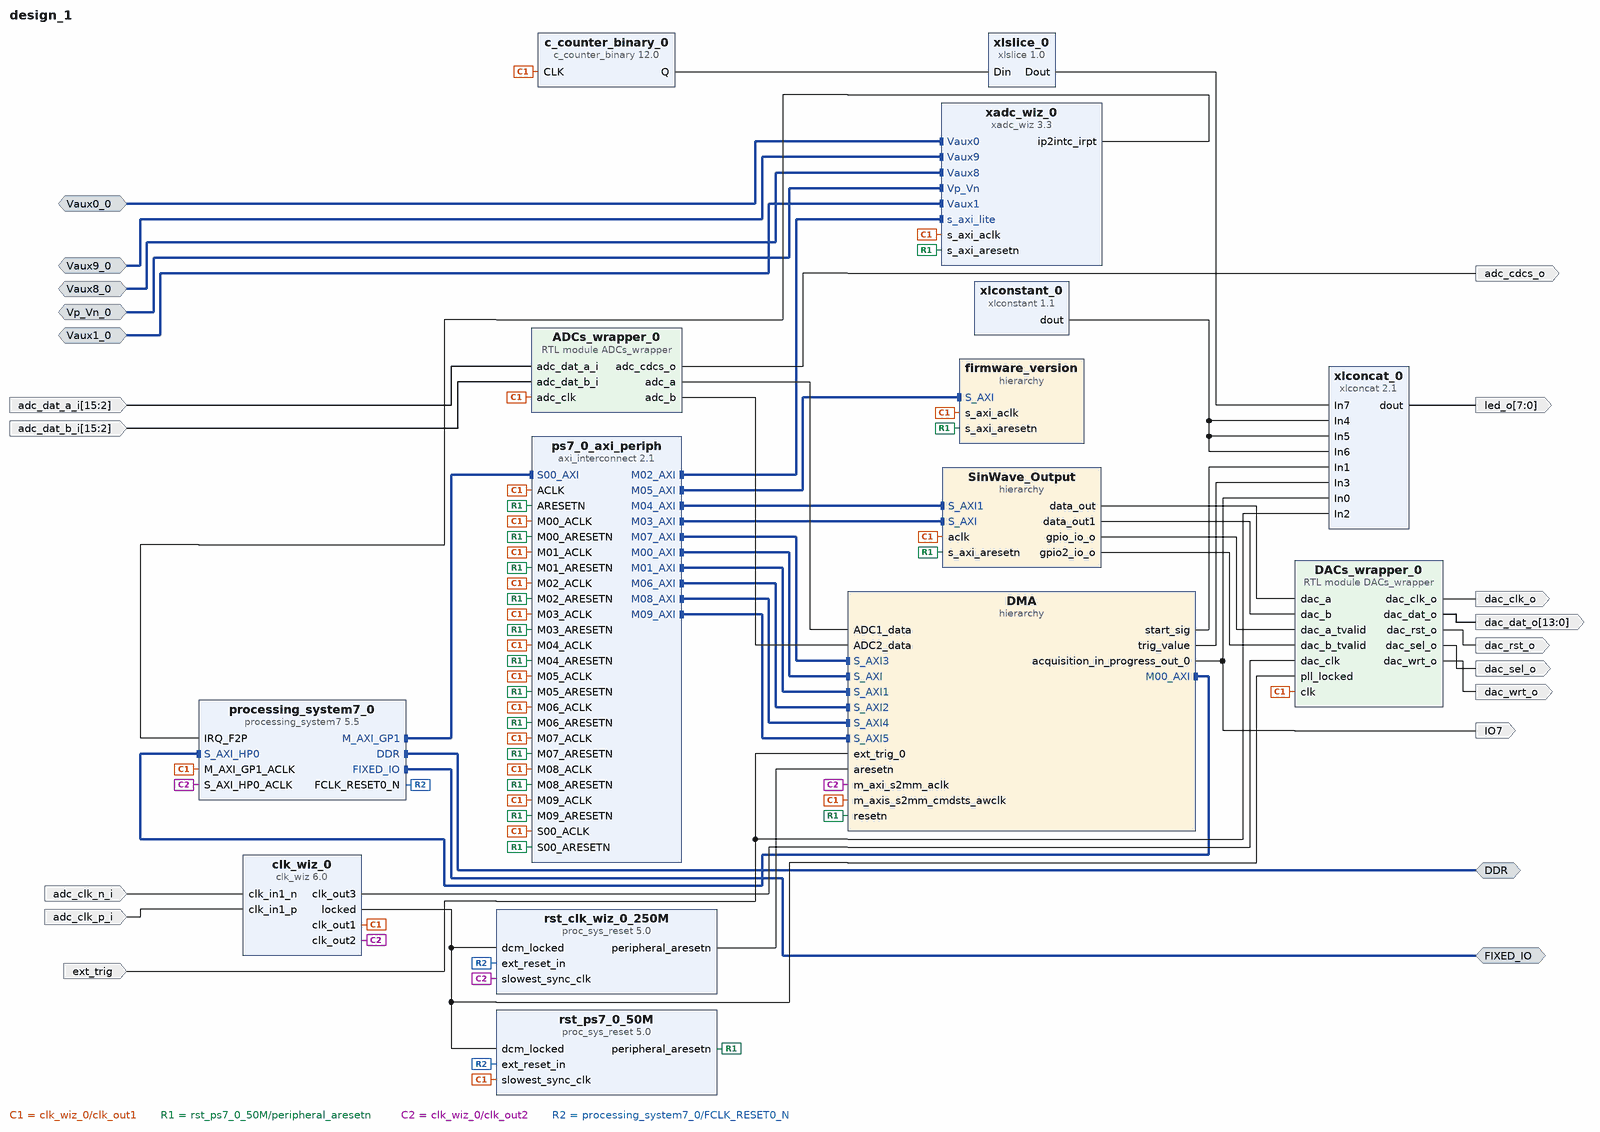
[diagram p0: block diagram of the top level]
# Vivado block design design_1, xc7z010clg400-1, Vivado 2019.1
create_bd_design design_1

create_bd_intf_port -mode Master -vlnv xilinx.com:interface:ddrx_rtl:1.0 DDR
create_bd_intf_port -mode Master -vlnv xilinx.com:display_processing_system7:fixedio_rtl:1.0 FIXED_IO
create_bd_intf_port -mode Slave -vlnv xilinx.com:interface:diff_analog_io_rtl:1.0 Vp_Vn_0
create_bd_intf_port -mode Slave -vlnv xilinx.com:interface:diff_analog_io_rtl:1.0 Vaux8_0
create_bd_intf_port -mode Slave -vlnv xilinx.com:interface:diff_analog_io_rtl:1.0 Vaux0_0
create_bd_intf_port -mode Slave -vlnv xilinx.com:interface:diff_analog_io_rtl:1.0 Vaux1_0
create_bd_intf_port -mode Slave -vlnv xilinx.com:interface:diff_analog_io_rtl:1.0 Vaux9_0
create_bd_port -dir I -type clk adc_clk_p_i
set_property -dict {CONFIG.FREQ_HZ 125000000} [get_bd_ports adc_clk_p_i]
create_bd_port -dir I -type clk adc_clk_n_i
set_property -dict {CONFIG.FREQ_HZ 125000000} [get_bd_ports adc_clk_n_i]
create_bd_port -dir I -from 15 -to 2 adc_dat_a_i
create_bd_port -dir I -from 15 -to 2 adc_dat_b_i
create_bd_port -dir O adc_cdcs_o
create_bd_port -dir O -from 13 -to 0 dac_dat_o
create_bd_port -dir O dac_wrt_o
create_bd_port -dir O dac_sel_o
create_bd_port -dir O dac_clk_o
create_bd_port -dir O dac_rst_o
create_bd_port -dir O IO7
create_bd_port -dir I ext_trig
create_bd_port -dir O -from 7 -to 0 led_o

create_bd_cell -type ip -vlnv xilinx.com:ip:processing_system7:5.5 processing_system7_0
set_property -dict [list \
  CONFIG.PCW_APU_PERIPHERAL_FREQMHZ 666.666666 \
  CONFIG.PCW_ENET0_ENET0_IO {MIO 16 .. 27} \
  CONFIG.PCW_ENET0_GRP_MDIO_ENABLE 1 \
  CONFIG.PCW_ENET0_GRP_MDIO_IO {MIO 52 .. 53} \
  CONFIG.PCW_ENET0_PERIPHERAL_ENABLE 1 \
  CONFIG.PCW_ENET0_RESET_ENABLE 0 \
  CONFIG.PCW_ENET_RESET_ENABLE 1 \
  CONFIG.PCW_ENET_RESET_SELECT {Share reset pin} \
  CONFIG.PCW_EN_CLK0_PORT 0 \
  CONFIG.PCW_FPGA0_PERIPHERAL_FREQMHZ 125 \
  CONFIG.PCW_FPGA1_PERIPHERAL_FREQMHZ 50 \
  CONFIG.PCW_GPIO_EMIO_GPIO_ENABLE 1 \
  CONFIG.PCW_GPIO_EMIO_GPIO_IO 64 \
  CONFIG.PCW_GPIO_MIO_GPIO_ENABLE 1 \
  CONFIG.PCW_GPIO_MIO_GPIO_IO MIO \
  CONFIG.PCW_GPIO_PERIPHERAL_ENABLE 1 \
  CONFIG.PCW_I2C0_GRP_INT_ENABLE 0 \
  CONFIG.PCW_I2C0_I2C0_IO {MIO 50 .. 51} \
  CONFIG.PCW_I2C0_PERIPHERAL_ENABLE 1 \
  CONFIG.PCW_I2C_PERIPHERAL_FREQMHZ 111.111115 \
  CONFIG.PCW_I2C_RESET_ENABLE 1 \
  CONFIG.PCW_I2C_RESET_SELECT {Share reset pin} \
  CONFIG.PCW_IMPORT_BOARD_PRESET {D:/Alex/Red Pitaya/red_pitaya.xml} \
  CONFIG.PCW_IRQ_F2P_INTR 1 \
  CONFIG.PCW_PRESET_BANK1_VOLTAGE {LVCMOS 2.5V} \
  CONFIG.PCW_QSPI_PERIPHERAL_ENABLE 0 \
  CONFIG.PCW_SD0_GRP_CD_ENABLE 1 \
  CONFIG.PCW_SD0_GRP_CD_IO {MIO 46} \
  CONFIG.PCW_SD0_GRP_WP_ENABLE 1 \
  CONFIG.PCW_SD0_GRP_WP_IO {MIO 47} \
  CONFIG.PCW_SD0_PERIPHERAL_ENABLE 1 \
  CONFIG.PCW_SD0_SD0_IO {MIO 40 .. 45} \
  CONFIG.PCW_SDIO_PERIPHERAL_FREQMHZ 100 \
  CONFIG.PCW_SPI0_PERIPHERAL_ENABLE 1 \
  CONFIG.PCW_SPI0_SPI0_IO EMIO \
  CONFIG.PCW_SPI1_PERIPHERAL_ENABLE 1 \
  CONFIG.PCW_SPI1_SPI1_IO {MIO 10 .. 15} \
  CONFIG.PCW_UART0_PERIPHERAL_ENABLE 1 \
  CONFIG.PCW_UART0_UART0_IO {MIO 14 .. 15} \
  CONFIG.PCW_UART1_PERIPHERAL_ENABLE 1 \
  CONFIG.PCW_UART1_UART1_IO {MIO 8 .. 9} \
  CONFIG.PCW_UART_PERIPHERAL_FREQMHZ 100 \
  CONFIG.PCW_UIPARAM_DDR_BUS_WIDTH {16 Bit} \
  CONFIG.PCW_UIPARAM_DDR_FREQ_MHZ 533.333333 \
  CONFIG.PCW_UIPARAM_DDR_PARTNO {MT41J256M16 RE-125} \
  CONFIG.PCW_USB0_PERIPHERAL_ENABLE 1 \
  CONFIG.PCW_USB0_RESET_ENABLE 1 \
  CONFIG.PCW_USB0_RESET_IO {MIO 48} \
  CONFIG.PCW_USB0_USB0_IO {MIO 28 .. 39} \
  CONFIG.PCW_USB_RESET_ENABLE 1 \
  CONFIG.PCW_USB_RESET_SELECT {Share reset pin} \
  CONFIG.PCW_USE_FABRIC_INTERRUPT 1 \
  CONFIG.PCW_USE_M_AXI_GP0 0 \
  CONFIG.PCW_USE_M_AXI_GP1 1 \
  CONFIG.PCW_USE_S_AXI_HP0 1 \
] [get_bd_cells processing_system7_0]
# 429 more settings of processing_system7_0 are not shown: defaults, MIO pin electricals, DDR timing, and values the tool derives
create_bd_cell -type ip -vlnv xilinx.com:ip:proc_sys_reset:5.0 rst_ps7_0_50M
create_bd_cell -type ip -vlnv xilinx.com:ip:clk_wiz:6.0 clk_wiz_0
set_property -dict [list \
  CONFIG.CLKIN1_JITTER_PS 80.0 \
  CONFIG.CLKOUT1_JITTER 119.348 \
  CONFIG.CLKOUT1_PHASE_ERROR 96.948 \
  CONFIG.CLKOUT1_REQUESTED_OUT_FREQ 125.000 \
  CONFIG.CLKOUT2_JITTER 109.241 \
  CONFIG.CLKOUT2_PHASE_ERROR 96.948 \
  CONFIG.CLKOUT2_REQUESTED_OUT_FREQ 200 \
  CONFIG.CLKOUT2_USED true \
  CONFIG.CLKOUT3_JITTER 104.759 \
  CONFIG.CLKOUT3_PHASE_ERROR 96.948 \
  CONFIG.CLKOUT3_REQUESTED_OUT_FREQ 250 \
  CONFIG.CLKOUT3_REQUESTED_PHASE 90 \
  CONFIG.CLKOUT3_USED true \
  CONFIG.MMCM_CLKFBOUT_MULT_F 8.000 \
  CONFIG.MMCM_CLKIN1_PERIOD 8.000 \
  CONFIG.MMCM_CLKOUT0_DIVIDE_F 8.000 \
  CONFIG.MMCM_CLKOUT1_DIVIDE 5 \
  CONFIG.MMCM_CLKOUT2_DIVIDE 4 \
  CONFIG.MMCM_CLKOUT2_PHASE 90.000 \
  CONFIG.NUM_OUT_CLKS 3 \
  CONFIG.PRIM_IN_FREQ 125.000 \
  CONFIG.PRIM_SOURCE Differential_clock_capable_pin \
  CONFIG.USE_RESET false \
] [get_bd_cells clk_wiz_0]
create_bd_cell -type ip -vlnv xilinx.com:ip:proc_sys_reset:5.0 rst_clk_wiz_0_250M
create_bd_cell -type ip -vlnv xilinx.com:ip:axi_interconnect:2.1 ps7_0_axi_periph
set_property -dict {CONFIG.NUM_MI 10} [get_bd_cells ps7_0_axi_periph]
create_bd_cell -type ip -vlnv xilinx.com:ip:xadc_wiz:3.3 xadc_wiz_0
set_property -dict [list \
  CONFIG.ADC_OFFSET_AND_GAIN_CALIBRATION false \
  CONFIG.CHANNEL_ENABLE_VAUXP0_VAUXN0 true \
  CONFIG.CHANNEL_ENABLE_VAUXP1_VAUXN1 true \
  CONFIG.CHANNEL_ENABLE_VAUXP8_VAUXN8 true \
  CONFIG.CHANNEL_ENABLE_VAUXP9_VAUXN9 true \
  CONFIG.CHANNEL_ENABLE_VP_VN true \
  CONFIG.EXTERNAL_MUX_CHANNEL VP_VN \
  CONFIG.SEQUENCER_MODE Off \
  CONFIG.SINGLE_CHANNEL_ENABLE_CALIBRATION true \
  CONFIG.SINGLE_CHANNEL_SELECTION TEMPERATURE \
  CONFIG.XADC_STARUP_SELECTION independent_adc \
] [get_bd_cells xadc_wiz_0]
create_bd_cell -type module -reference ADCs_wrapper ADCs_wrapper_0
create_bd_cell -type module -reference DACs_wrapper DACs_wrapper_0
create_bd_cell -type hier firmware_version
create_bd_cell -type hier SinWave_Output
create_bd_cell -type hier DMA
create_bd_cell -type ip -vlnv xilinx.com:ip:xlconcat:2.1 xlconcat_0
set_property -dict {CONFIG.NUM_PORTS 8} [get_bd_cells xlconcat_0]
create_bd_cell -type ip -vlnv xilinx.com:ip:c_counter_binary:12.0 c_counter_binary_0
set_property -dict {CONFIG.Output_Width 27} [get_bd_cells c_counter_binary_0]
create_bd_cell -type ip -vlnv xilinx.com:ip:xlslice:1.0 xlslice_0
set_property -dict {CONFIG.DIN_FROM 26 CONFIG.DIN_TO 26 CONFIG.DIN_WIDTH 27 CONFIG.DOUT_WIDTH 1} [get_bd_cells xlslice_0]
create_bd_cell -type ip -vlnv xilinx.com:ip:xlconstant:1.1 xlconstant_0
set_property -dict {CONFIG.CONST_VAL 0} [get_bd_cells xlconstant_0]

# ---- hierarchy /firmware_version ----
current_bd_instance /firmware_version
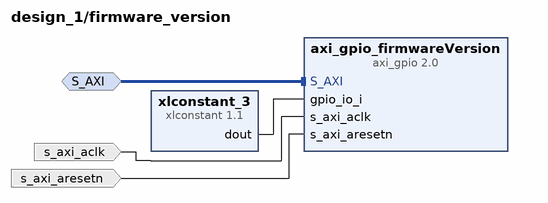
[diagram p1: block diagram inside /firmware_version]
create_bd_intf_pin -mode Slave -vlnv xilinx.com:interface:aximm_rtl:1.0 S_AXI
create_bd_pin -dir I -type clk s_axi_aclk
create_bd_pin -dir I -type rst s_axi_aresetn

create_bd_cell -type ip -vlnv xilinx.com:ip:xlconstant:1.1 xlconstant_3
set_property -dict {CONFIG.CONST_VAL 0xADC00003 CONFIG.CONST_WIDTH 32} [get_bd_cells xlconstant_3]
create_bd_cell -type ip -vlnv xilinx.com:ip:axi_gpio:2.0 axi_gpio_firmwareVersion
set_property -dict {CONFIG.C_ALL_INPUTS 1} [get_bd_cells axi_gpio_firmwareVersion]

# ---- hierarchy /SinWave_Output ----
current_bd_instance /SinWave_Output
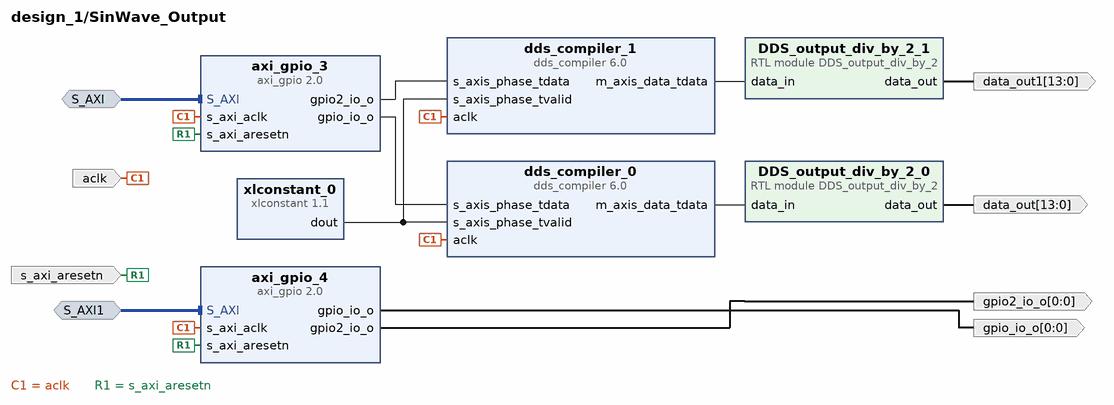
[diagram p2: block diagram inside /SinWave_Output]
create_bd_intf_pin -mode Slave -vlnv xilinx.com:interface:aximm_rtl:1.0 S_AXI
create_bd_intf_pin -mode Slave -vlnv xilinx.com:interface:aximm_rtl:1.0 S_AXI1
create_bd_pin -dir O -from 13 -to 0 data_out
create_bd_pin -dir O -from 13 -to 0 data_out1
create_bd_pin -dir I -type clk aclk
create_bd_pin -dir I -type rst s_axi_aresetn
create_bd_pin -dir O -from 0 -to 0 gpio_io_o
create_bd_pin -dir O -from 0 -to 0 gpio2_io_o

create_bd_cell -type module -reference DDS_output_div_by_2 DDS_output_div_by_2_0
create_bd_cell -type module -reference DDS_output_div_by_2 DDS_output_div_by_2_1
create_bd_cell -type ip -vlnv xilinx.com:ip:dds_compiler:6.0 dds_compiler_0
set_property -dict [list \
  CONFIG.DATA_Has_TLAST Not_Required \
  CONFIG.DDS_Clock_Rate 125 \
  CONFIG.DSP48_Use Maximal \
  CONFIG.Frequency_Resolution 0.4 \
  CONFIG.Has_Phase_Out false \
  CONFIG.Latency 8 \
  CONFIG.M_DATA_Has_TUSER Not_Required \
  CONFIG.Noise_Shaping None \
  CONFIG.Output_Frequency1 0 \
  CONFIG.Output_Selection Sine \
  CONFIG.Output_Width 14 \
  CONFIG.PINC1 0 \
  CONFIG.Parameter_Entry Hardware_Parameters \
  CONFIG.PartsPresent Phase_Generator_and_SIN_COS_LUT \
  CONFIG.Phase_Increment Streaming \
  CONFIG.Phase_Width 32 \
  CONFIG.Phase_offset None \
  CONFIG.S_PHASE_Has_TUSER Not_Required \
] [get_bd_cells dds_compiler_0]
create_bd_cell -type ip -vlnv xilinx.com:ip:dds_compiler:6.0 dds_compiler_1
set_property -dict [list \
  CONFIG.DATA_Has_TLAST Not_Required \
  CONFIG.DDS_Clock_Rate 125 \
  CONFIG.DSP48_Use Maximal \
  CONFIG.Frequency_Resolution 0.4 \
  CONFIG.Has_Phase_Out false \
  CONFIG.Latency 8 \
  CONFIG.M_DATA_Has_TUSER Not_Required \
  CONFIG.Noise_Shaping None \
  CONFIG.Output_Frequency1 0 \
  CONFIG.Output_Selection Sine \
  CONFIG.Output_Width 14 \
  CONFIG.PINC1 0 \
  CONFIG.Parameter_Entry Hardware_Parameters \
  CONFIG.PartsPresent Phase_Generator_and_SIN_COS_LUT \
  CONFIG.Phase_Increment Streaming \
  CONFIG.Phase_Width 32 \
  CONFIG.Phase_offset None \
  CONFIG.S_PHASE_Has_TUSER Not_Required \
] [get_bd_cells dds_compiler_1]
create_bd_cell -type ip -vlnv xilinx.com:ip:axi_gpio:2.0 axi_gpio_3
set_property -dict {CONFIG.C_ALL_OUTPUTS 1 CONFIG.C_ALL_OUTPUTS_2 1 CONFIG.C_IS_DUAL 1} [get_bd_cells axi_gpio_3]
create_bd_cell -type ip -vlnv xilinx.com:ip:axi_gpio:2.0 axi_gpio_4
set_property -dict [list \
  CONFIG.C_ALL_OUTPUTS 1 \
  CONFIG.C_ALL_OUTPUTS_2 1 \
  CONFIG.C_GPIO2_WIDTH 1 \
  CONFIG.C_GPIO_WIDTH 1 \
  CONFIG.C_IS_DUAL 1 \
] [get_bd_cells axi_gpio_4]
create_bd_cell -type ip -vlnv xilinx.com:ip:xlconstant:1.1 xlconstant_0

# ---- hierarchy /DMA ----
current_bd_instance /DMA
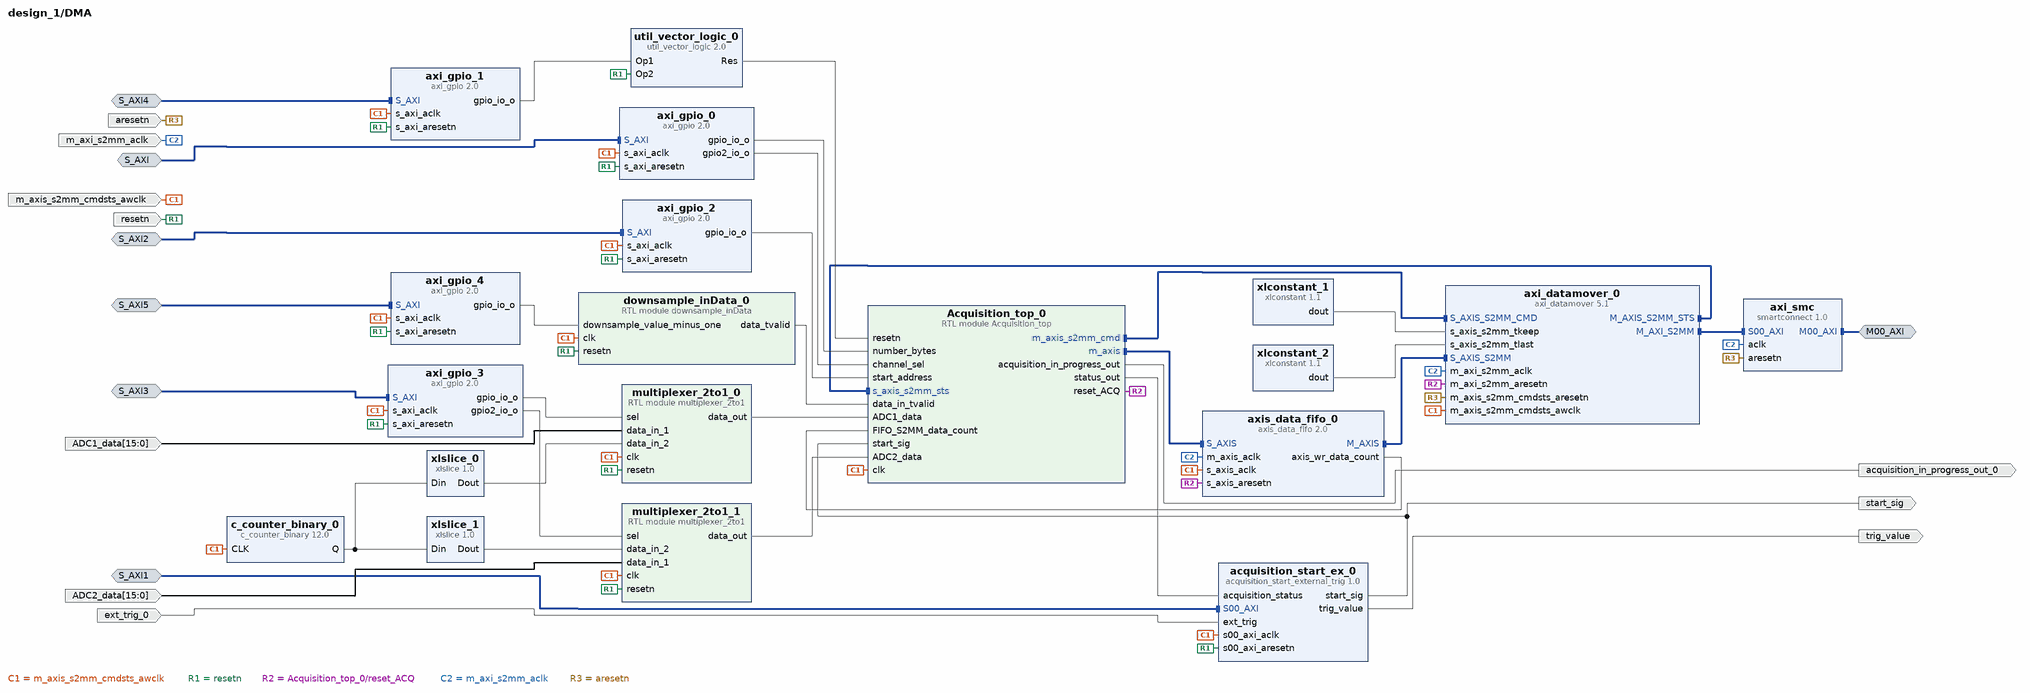
[diagram p3: block diagram inside /DMA]
create_bd_intf_pin -mode Slave -vlnv xilinx.com:interface:aximm_rtl:1.0 S_AXI
create_bd_intf_pin -mode Master -vlnv xilinx.com:interface:aximm_rtl:1.0 M00_AXI
create_bd_intf_pin -mode Slave -vlnv xilinx.com:interface:aximm_rtl:1.0 S_AXI1
create_bd_intf_pin -mode Slave -vlnv xilinx.com:interface:aximm_rtl:1.0 S_AXI2
create_bd_intf_pin -mode Slave -vlnv xilinx.com:interface:aximm_rtl:1.0 S_AXI3
create_bd_intf_pin -mode Slave -vlnv xilinx.com:interface:aximm_rtl:1.0 S_AXI4
create_bd_intf_pin -mode Slave -vlnv xilinx.com:interface:aximm_rtl:1.0 S_AXI5
create_bd_pin -dir I -type clk m_axis_s2mm_cmdsts_awclk
create_bd_pin -dir I -type rst resetn
create_bd_pin -dir I -type clk m_axi_s2mm_aclk
create_bd_pin -dir I -type rst aresetn
create_bd_pin -dir I -from 15 -to 0 ADC1_data
create_bd_pin -dir I -from 15 -to 0 ADC2_data
create_bd_pin -dir O acquisition_in_progress_out_0
create_bd_pin -dir I ext_trig_0
create_bd_pin -dir O start_sig
create_bd_pin -dir O trig_value

create_bd_cell -type ip -vlnv xilinx.com:ip:xlconstant:1.1 xlconstant_1
set_property -dict {CONFIG.CONST_VAL 255 CONFIG.CONST_WIDTH 8} [get_bd_cells xlconstant_1]
create_bd_cell -type ip -vlnv xilinx.com:ip:axi_gpio:2.0 axi_gpio_0
set_property -dict [list \
  CONFIG.C_ALL_OUTPUTS 1 \
  CONFIG.C_ALL_OUTPUTS_2 1 \
  CONFIG.C_GPIO2_WIDTH 2 \
  CONFIG.C_IS_DUAL 1 \
] [get_bd_cells axi_gpio_0]
create_bd_cell -type ip -vlnv xilinx.com:ip:smartconnect:1.0 axi_smc
set_property -dict {CONFIG.NUM_SI 1} [get_bd_cells axi_smc]
create_bd_cell -type ip -vlnv xilinx.com:ip:axis_data_fifo:2.0 axis_data_fifo_0
set_property -dict [list \
  CONFIG.FIFO_DEPTH 128 \
  CONFIG.HAS_AFULL 1 \
  CONFIG.HAS_RD_DATA_COUNT 1 \
  CONFIG.HAS_TKEEP 0 \
  CONFIG.HAS_TLAST 0 \
  CONFIG.HAS_WR_DATA_COUNT 1 \
  CONFIG.IS_ACLK_ASYNC 1 \
  CONFIG.TDATA_NUM_BYTES 8 \
] [get_bd_cells axis_data_fifo_0]
create_bd_cell -type ip -vlnv xilinx.com:ip:xlconstant:1.1 xlconstant_2
set_property -dict {CONFIG.CONST_VAL 0} [get_bd_cells xlconstant_2]
create_bd_cell -type ip -vlnv xilinx.com:ip:axi_gpio:2.0 axi_gpio_2
set_property -dict {CONFIG.C_ALL_OUTPUTS 1 CONFIG.C_DOUT_DEFAULT 0x1e000000} [get_bd_cells axi_gpio_2]
create_bd_cell -type ip -vlnv xilinx.com:ip:axi_datamover:5.1 axi_datamover_0
set_property -dict [list \
  CONFIG.c_dummy 0 \
  CONFIG.c_enable_mm2s 0 \
  CONFIG.c_m_axi_s2mm_data_width 64 \
  CONFIG.c_m_axi_s2mm_id_width 0 \
  CONFIG.c_s2mm_btt_used 23 \
  CONFIG.c_s2mm_burst_size 256 \
  CONFIG.c_s_axis_s2mm_tdata_width 64 \
] [get_bd_cells axi_datamover_0]
create_bd_cell -type ip -vlnv xilinx.com:ip:xlslice:1.0 xlslice_1
set_property -dict {CONFIG.DIN_FROM 15 CONFIG.DOUT_WIDTH 16} [get_bd_cells xlslice_1]
create_bd_cell -type ip -vlnv xilinx.com:ip:c_counter_binary:12.0 c_counter_binary_0
set_property -dict {CONFIG.Output_Width 32} [get_bd_cells c_counter_binary_0]
create_bd_cell -type ip -vlnv xilinx.com:ip:xlslice:1.0 xlslice_0
set_property -dict {CONFIG.DIN_FROM 31 CONFIG.DIN_TO 16 CONFIG.DOUT_WIDTH 16} [get_bd_cells xlslice_0]
create_bd_cell -type ip -vlnv xilinx.com:ip:axi_gpio:2.0 axi_gpio_3
set_property -dict [list \
  CONFIG.C_ALL_OUTPUTS 1 \
  CONFIG.C_ALL_OUTPUTS_2 1 \
  CONFIG.C_GPIO2_WIDTH 1 \
  CONFIG.C_GPIO_WIDTH 1 \
  CONFIG.C_IS_DUAL 1 \
] [get_bd_cells axi_gpio_3]
create_bd_cell -type module -reference multiplexer_2to1 multiplexer_2to1_0
create_bd_cell -type module -reference multiplexer_2to1 multiplexer_2to1_1
create_bd_cell -type ip -vlnv xilinx.com:ip:util_vector_logic:2.0 util_vector_logic_0
set_property -dict {CONFIG.C_SIZE 1} [get_bd_cells util_vector_logic_0]
create_bd_cell -type ip -vlnv xilinx.com:ip:axi_gpio:2.0 axi_gpio_1
set_property -dict {CONFIG.C_ALL_OUTPUTS 1 CONFIG.C_DOUT_DEFAULT 0x00000001 CONFIG.C_GPIO_WIDTH 1} [get_bd_cells axi_gpio_1]
create_bd_cell -type ip -vlnv xilinx.com:user:acquisition_start_external_trig:1.0 acquisition_start_ex_0
create_bd_cell -type module -reference Acquisition_top Acquisition_top_0
create_bd_cell -type ip -vlnv xilinx.com:ip:axi_gpio:2.0 axi_gpio_4
set_property -dict {CONFIG.C_ALL_OUTPUTS 1 CONFIG.C_DOUT_DEFAULT 0x00000000} [get_bd_cells axi_gpio_4]
create_bd_cell -type module -reference downsample_inData downsample_inData_0

# ---- connections ----

current_bd_instance /firmware_version
connect_bd_intf_net [get_bd_intf_pins S_AXI] [get_bd_intf_pins axi_gpio_firmwareVersion/S_AXI]
connect_bd_net [get_bd_pins xlconstant_3/dout] [get_bd_pins axi_gpio_firmwareVersion/gpio_io_i]
connect_bd_net -net processing_system7_0_FCLK_CLK0 [get_bd_pins s_axi_aclk] [get_bd_pins axi_gpio_firmwareVersion/s_axi_aclk]
connect_bd_net -net rst_ps7_0_50M_peripheral_aresetn [get_bd_pins s_axi_aresetn] [get_bd_pins axi_gpio_firmwareVersion/s_axi_aresetn]

current_bd_instance /SinWave_Output
connect_bd_intf_net [get_bd_intf_pins S_AXI] [get_bd_intf_pins axi_gpio_3/S_AXI]
connect_bd_intf_net [get_bd_intf_pins S_AXI1] [get_bd_intf_pins axi_gpio_4/S_AXI]
connect_bd_net [get_bd_pins dds_compiler_0/m_axis_data_tdata] [get_bd_pins DDS_output_div_by_2_0/data_in]
connect_bd_net [get_bd_pins dds_compiler_1/m_axis_data_tdata] [get_bd_pins DDS_output_div_by_2_1/data_in]
connect_bd_net -net axi_gpio_2_gpio_io_o [get_bd_pins axi_gpio_3/gpio_io_o] [get_bd_pins dds_compiler_0/s_axis_phase_tdata]
connect_bd_net -net axi_gpio_2_gpio2_io_o [get_bd_pins axi_gpio_3/gpio2_io_o] [get_bd_pins dds_compiler_1/s_axis_phase_tdata]
connect_bd_net -net dds_compiler_0_m_axis_data_tdata [get_bd_pins DDS_output_div_by_2_0/data_out] [get_bd_pins data_out]
connect_bd_net [get_bd_pins DDS_output_div_by_2_1/data_out] [get_bd_pins data_out1]
connect_bd_net -net processing_system7_0_FCLK_CLK0 [get_bd_pins aclk] \
  [get_bd_pins dds_compiler_1/aclk] [get_bd_pins axi_gpio_3/s_axi_aclk] [get_bd_pins dds_compiler_0/aclk] \
  [get_bd_pins axi_gpio_4/s_axi_aclk]
connect_bd_net [get_bd_pins xlconstant_0/dout] [get_bd_pins dds_compiler_1/s_axis_phase_tvalid] [get_bd_pins dds_compiler_0/s_axis_phase_tvalid]
connect_bd_net -net rst_ps7_0_50M_peripheral_aresetn [get_bd_pins s_axi_aresetn] \
  [get_bd_pins axi_gpio_3/s_axi_aresetn] [get_bd_pins axi_gpio_4/s_axi_aresetn]
connect_bd_net -net axi_gpio_3_gpio_io_o [get_bd_pins axi_gpio_4/gpio_io_o] [get_bd_pins gpio_io_o]
connect_bd_net -net axi_gpio_3_gpio2_io_o [get_bd_pins axi_gpio_4/gpio2_io_o] [get_bd_pins gpio2_io_o]

current_bd_instance /DMA
connect_bd_intf_net [get_bd_intf_pins Acquisition_top_0/m_axis] [get_bd_intf_pins axis_data_fifo_0/S_AXIS]
connect_bd_intf_net [get_bd_intf_pins S_AXI3] [get_bd_intf_pins axi_gpio_3/S_AXI]
connect_bd_intf_net [get_bd_intf_pins S_AXI5] [get_bd_intf_pins axi_gpio_4/S_AXI]
connect_bd_intf_net [get_bd_intf_pins S_AXI4] [get_bd_intf_pins axi_gpio_1/S_AXI]
connect_bd_intf_net [get_bd_intf_pins axi_datamover_0/M_AXIS_S2MM_STS] [get_bd_intf_pins Acquisition_top_0/s_axis_s2mm_sts]
connect_bd_intf_net [get_bd_intf_pins axis_data_fifo_0/M_AXIS] [get_bd_intf_pins axi_datamover_0/S_AXIS_S2MM]
connect_bd_intf_net [get_bd_intf_pins S_AXI2] [get_bd_intf_pins axi_gpio_2/S_AXI]
connect_bd_intf_net [get_bd_intf_pins M00_AXI] [get_bd_intf_pins axi_smc/M00_AXI]
connect_bd_intf_net [get_bd_intf_pins Acquisition_top_0/m_axis_s2mm_cmd] [get_bd_intf_pins axi_datamover_0/S_AXIS_S2MM_CMD]
connect_bd_intf_net -intf_net S_AXI1_1 [get_bd_intf_pins S_AXI1] [get_bd_intf_pins acquisition_start_ex_0/S00_AXI]
connect_bd_intf_net [get_bd_intf_pins axi_datamover_0/M_AXI_S2MM] [get_bd_intf_pins axi_smc/S00_AXI]
connect_bd_intf_net [get_bd_intf_pins S_AXI] [get_bd_intf_pins axi_gpio_0/S_AXI]
connect_bd_net -net processing_system7_0_FCLK_CLK0 [get_bd_pins m_axis_s2mm_cmdsts_awclk] \
  [get_bd_pins axi_gpio_0/s_axi_aclk] [get_bd_pins axis_data_fifo_0/s_axis_aclk] [get_bd_pins axi_gpio_2/s_axi_aclk] \
  [get_bd_pins axi_datamover_0/m_axis_s2mm_cmdsts_awclk] [get_bd_pins c_counter_binary_0/CLK] \
  [get_bd_pins axi_gpio_3/s_axi_aclk] [get_bd_pins multiplexer_2to1_0/clk] [get_bd_pins multiplexer_2to1_1/clk] \
  [get_bd_pins axi_gpio_1/s_axi_aclk] [get_bd_pins acquisition_start_ex_0/s00_axi_aclk] [get_bd_pins Acquisition_top_0/clk] \
  [get_bd_pins axi_gpio_4/s_axi_aclk] [get_bd_pins downsample_inData_0/clk]
connect_bd_net -net rst_ps7_0_50M_peripheral_aresetn [get_bd_pins resetn] \
  [get_bd_pins axi_gpio_0/s_axi_aresetn] [get_bd_pins axi_gpio_2/s_axi_aresetn] [get_bd_pins axi_gpio_3/s_axi_aresetn] \
  [get_bd_pins multiplexer_2to1_0/resetn] [get_bd_pins multiplexer_2to1_1/resetn] [get_bd_pins util_vector_logic_0/Op2] \
  [get_bd_pins axi_gpio_1/s_axi_aresetn] [get_bd_pins acquisition_start_ex_0/s00_axi_aresetn] \
  [get_bd_pins axi_gpio_4/s_axi_aresetn] [get_bd_pins downsample_inData_0/resetn]
connect_bd_net [get_bd_pins Acquisition_top_0/reset_ACQ] \
  [get_bd_pins axis_data_fifo_0/s_axis_aresetn] [get_bd_pins axi_datamover_0/m_axi_s2mm_aresetn]
connect_bd_net -net clk_wiz_0_clk_out2 [get_bd_pins m_axi_s2mm_aclk] \
  [get_bd_pins axi_smc/aclk] [get_bd_pins axis_data_fifo_0/m_axis_aclk] [get_bd_pins axi_datamover_0/m_axi_s2mm_aclk]
connect_bd_net [get_bd_pins axi_gpio_0/gpio_io_o] [get_bd_pins Acquisition_top_0/number_bytes]
connect_bd_net [get_bd_pins axi_gpio_0/gpio2_io_o] [get_bd_pins Acquisition_top_0/channel_sel]
connect_bd_net [get_bd_pins aresetn] [get_bd_pins axi_smc/aresetn] [get_bd_pins axi_datamover_0/m_axis_s2mm_cmdsts_aresetn]
connect_bd_net [get_bd_pins axis_data_fifo_0/axis_wr_data_count] [get_bd_pins Acquisition_top_0/FIFO_S2MM_data_count]
connect_bd_net [get_bd_pins axi_gpio_2/gpio_io_o] [get_bd_pins Acquisition_top_0/start_address]
connect_bd_net [get_bd_pins xlconstant_1/dout] [get_bd_pins axi_datamover_0/s_axis_s2mm_tkeep]
connect_bd_net [get_bd_pins xlconstant_2/dout] [get_bd_pins axi_datamover_0/s_axis_s2mm_tlast]
connect_bd_net [get_bd_pins c_counter_binary_0/Q] [get_bd_pins xlslice_1/Din] [get_bd_pins xlslice_0/Din]
connect_bd_net -net data_in_1_0_1 [get_bd_pins ADC1_data] [get_bd_pins multiplexer_2to1_0/data_in_1]
connect_bd_net -net data_in_1_1_1 [get_bd_pins ADC2_data] [get_bd_pins multiplexer_2to1_1/data_in_1]
connect_bd_net [get_bd_pins xlslice_0/Dout] [get_bd_pins multiplexer_2to1_0/data_in_2]
connect_bd_net [get_bd_pins xlslice_1/Dout] [get_bd_pins multiplexer_2to1_1/data_in_2]
connect_bd_net [get_bd_pins multiplexer_2to1_1/data_out] [get_bd_pins Acquisition_top_0/ADC2_data]
connect_bd_net [get_bd_pins multiplexer_2to1_0/data_out] [get_bd_pins Acquisition_top_0/ADC1_data]
connect_bd_net [get_bd_pins axi_gpio_3/gpio_io_o] [get_bd_pins multiplexer_2to1_0/sel]
connect_bd_net [get_bd_pins axi_gpio_3/gpio2_io_o] [get_bd_pins multiplexer_2to1_1/sel]
connect_bd_net [get_bd_pins Acquisition_top_0/acquisition_in_progress_out] [get_bd_pins acquisition_in_progress_out_0]
connect_bd_net [get_bd_pins acquisition_start_ex_0/start_sig] [get_bd_pins start_sig] [get_bd_pins Acquisition_top_0/start_sig]
connect_bd_net [get_bd_pins Acquisition_top_0/status_out] [get_bd_pins acquisition_start_ex_0/acquisition_status]
connect_bd_net -net ext_trig_0_1 [get_bd_pins ext_trig_0] [get_bd_pins acquisition_start_ex_0/ext_trig]
connect_bd_net [get_bd_pins acquisition_start_ex_0/trig_value] [get_bd_pins trig_value]
connect_bd_net [get_bd_pins util_vector_logic_0/Res] [get_bd_pins Acquisition_top_0/resetn]
connect_bd_net [get_bd_pins axi_gpio_1/gpio_io_o] [get_bd_pins util_vector_logic_0/Op1]
connect_bd_net [get_bd_pins axi_gpio_4/gpio_io_o] [get_bd_pins downsample_inData_0/downsample_value_minus_one]
connect_bd_net [get_bd_pins downsample_inData_0/data_tvalid] [get_bd_pins Acquisition_top_0/data_in_tvalid]

current_bd_instance /
connect_bd_intf_net [get_bd_intf_ports DDR] [get_bd_intf_pins processing_system7_0/DDR]
connect_bd_intf_net [get_bd_intf_ports FIXED_IO] [get_bd_intf_pins processing_system7_0/FIXED_IO]
connect_bd_intf_net [get_bd_intf_pins ps7_0_axi_periph/M04_AXI] [get_bd_intf_pins SinWave_Output/S_AXI1]
connect_bd_intf_net -intf_net Vaux0_0_1 [get_bd_intf_ports Vaux0_0] [get_bd_intf_pins xadc_wiz_0/Vaux0]
connect_bd_intf_net [get_bd_intf_pins ps7_0_axi_periph/M07_AXI] [get_bd_intf_pins DMA/S_AXI3]
connect_bd_intf_net [get_bd_intf_pins ps7_0_axi_periph/M05_AXI] [get_bd_intf_pins firmware_version/S_AXI]
connect_bd_intf_net [get_bd_intf_pins ps7_0_axi_periph/M03_AXI] [get_bd_intf_pins SinWave_Output/S_AXI]
connect_bd_intf_net -intf_net Vaux9_0_1 [get_bd_intf_ports Vaux9_0] [get_bd_intf_pins xadc_wiz_0/Vaux9]
connect_bd_intf_net -intf_net Vaux8_0_1 [get_bd_intf_ports Vaux8_0] [get_bd_intf_pins xadc_wiz_0/Vaux8]
connect_bd_intf_net -intf_net Vp_Vn_0_1 [get_bd_intf_ports Vp_Vn_0] [get_bd_intf_pins xadc_wiz_0/Vp_Vn]
connect_bd_intf_net -intf_net Vaux1_0_1 [get_bd_intf_ports Vaux1_0] [get_bd_intf_pins xadc_wiz_0/Vaux1]
connect_bd_intf_net [get_bd_intf_pins ps7_0_axi_periph/M00_AXI] [get_bd_intf_pins DMA/S_AXI]
connect_bd_intf_net [get_bd_intf_pins ps7_0_axi_periph/M01_AXI] [get_bd_intf_pins DMA/S_AXI1]
connect_bd_intf_net [get_bd_intf_pins ps7_0_axi_periph/M06_AXI] [get_bd_intf_pins DMA/S_AXI2]
connect_bd_intf_net [get_bd_intf_pins ps7_0_axi_periph/M08_AXI] [get_bd_intf_pins DMA/S_AXI4]
connect_bd_intf_net [get_bd_intf_pins processing_system7_0/S_AXI_HP0] [get_bd_intf_pins DMA/M00_AXI]
connect_bd_intf_net [get_bd_intf_pins processing_system7_0/M_AXI_GP1] [get_bd_intf_pins ps7_0_axi_periph/S00_AXI]
connect_bd_intf_net [get_bd_intf_pins ps7_0_axi_periph/M02_AXI] [get_bd_intf_pins xadc_wiz_0/s_axi_lite]
connect_bd_intf_net [get_bd_intf_pins ps7_0_axi_periph/M09_AXI] [get_bd_intf_pins DMA/S_AXI5]
connect_bd_net -net processing_system7_0_FCLK_CLK0 [get_bd_pins clk_wiz_0/clk_out1] \
  [get_bd_pins rst_ps7_0_50M/slowest_sync_clk] [get_bd_pins ps7_0_axi_periph/M00_ACLK] \
  [get_bd_pins ps7_0_axi_periph/S00_ACLK] [get_bd_pins ps7_0_axi_periph/ACLK] [get_bd_pins ps7_0_axi_periph/M01_ACLK] \
  [get_bd_pins processing_system7_0/M_AXI_GP1_ACLK] [get_bd_pins xadc_wiz_0/s_axi_aclk] \
  [get_bd_pins ps7_0_axi_periph/M02_ACLK] [get_bd_pins ps7_0_axi_periph/M03_ACLK] [get_bd_pins ADCs_wrapper_0/adc_clk] \
  [get_bd_pins ps7_0_axi_periph/M04_ACLK] [get_bd_pins DACs_wrapper_0/clk] [get_bd_pins ps7_0_axi_periph/M05_ACLK] \
  [get_bd_pins firmware_version/s_axi_aclk] [get_bd_pins SinWave_Output/aclk] [get_bd_pins DMA/m_axis_s2mm_cmdsts_awclk] \
  [get_bd_pins ps7_0_axi_periph/M06_ACLK] [get_bd_pins ps7_0_axi_periph/M07_ACLK] [get_bd_pins c_counter_binary_0/CLK] \
  [get_bd_pins ps7_0_axi_periph/M08_ACLK] [get_bd_pins ps7_0_axi_periph/M09_ACLK]
connect_bd_net [get_bd_pins rst_ps7_0_50M/peripheral_aresetn] \
  [get_bd_pins ps7_0_axi_periph/M00_ARESETN] [get_bd_pins ps7_0_axi_periph/S00_ARESETN] \
  [get_bd_pins ps7_0_axi_periph/ARESETN] [get_bd_pins ps7_0_axi_periph/M01_ARESETN] [get_bd_pins xadc_wiz_0/s_axi_aresetn] \
  [get_bd_pins ps7_0_axi_periph/M02_ARESETN] [get_bd_pins ps7_0_axi_periph/M03_ARESETN] \
  [get_bd_pins ps7_0_axi_periph/M04_ARESETN] [get_bd_pins ps7_0_axi_periph/M05_ARESETN] \
  [get_bd_pins firmware_version/s_axi_aresetn] [get_bd_pins SinWave_Output/s_axi_aresetn] [get_bd_pins DMA/resetn] \
  [get_bd_pins ps7_0_axi_periph/M06_ARESETN] [get_bd_pins ps7_0_axi_periph/M07_ARESETN] \
  [get_bd_pins ps7_0_axi_periph/M08_ARESETN] [get_bd_pins ps7_0_axi_periph/M09_ARESETN]
connect_bd_net [get_bd_pins clk_wiz_0/locked] \
  [get_bd_pins rst_ps7_0_50M/dcm_locked] [get_bd_pins rst_clk_wiz_0_250M/dcm_locked] [get_bd_pins DACs_wrapper_0/pll_locked]
connect_bd_net [get_bd_pins clk_wiz_0/clk_out2] \
  [get_bd_pins processing_system7_0/S_AXI_HP0_ACLK] [get_bd_pins rst_clk_wiz_0_250M/slowest_sync_clk] \
  [get_bd_pins DMA/m_axi_s2mm_aclk]
connect_bd_net [get_bd_ports adc_clk_n_i] [get_bd_pins clk_wiz_0/clk_in1_n]
connect_bd_net [get_bd_ports adc_clk_p_i] [get_bd_pins clk_wiz_0/clk_in1_p]
connect_bd_net [get_bd_pins processing_system7_0/FCLK_RESET0_N] [get_bd_pins rst_clk_wiz_0_250M/ext_reset_in] [get_bd_pins rst_ps7_0_50M/ext_reset_in]
connect_bd_net [get_bd_pins xadc_wiz_0/ip2intc_irpt] [get_bd_pins processing_system7_0/IRQ_F2P]
connect_bd_net [get_bd_ports adc_dat_a_i] [get_bd_pins ADCs_wrapper_0/adc_dat_a_i]
connect_bd_net [get_bd_ports adc_dat_b_i] [get_bd_pins ADCs_wrapper_0/adc_dat_b_i]
connect_bd_net [get_bd_pins ADCs_wrapper_0/adc_cdcs_o] [get_bd_ports adc_cdcs_o]
connect_bd_net [get_bd_pins clk_wiz_0/clk_out3] [get_bd_pins DACs_wrapper_0/dac_clk]
connect_bd_net [get_bd_pins DACs_wrapper_0/dac_dat_o] [get_bd_ports dac_dat_o]
connect_bd_net [get_bd_pins DACs_wrapper_0/dac_wrt_o] [get_bd_ports dac_wrt_o]
connect_bd_net [get_bd_pins DACs_wrapper_0/dac_sel_o] [get_bd_ports dac_sel_o]
connect_bd_net [get_bd_pins DACs_wrapper_0/dac_clk_o] [get_bd_ports dac_clk_o]
connect_bd_net [get_bd_pins DACs_wrapper_0/dac_rst_o] [get_bd_ports dac_rst_o]
connect_bd_net -net dds_compiler_0_m_axis_data_tdata [get_bd_pins SinWave_Output/data_out] [get_bd_pins DACs_wrapper_0/dac_a]
connect_bd_net -net DDS_output_div_by_2_1_data_out [get_bd_pins SinWave_Output/data_out1] [get_bd_pins DACs_wrapper_0/dac_b]
connect_bd_net [get_bd_pins SinWave_Output/gpio_io_o] [get_bd_pins DACs_wrapper_0/dac_a_tvalid]
connect_bd_net [get_bd_pins SinWave_Output/gpio2_io_o] [get_bd_pins DACs_wrapper_0/dac_b_tvalid]
connect_bd_net [get_bd_pins rst_clk_wiz_0_250M/peripheral_aresetn] [get_bd_pins DMA/aresetn]
connect_bd_net [get_bd_pins ADCs_wrapper_0/adc_a] [get_bd_pins DMA/ADC1_data]
connect_bd_net [get_bd_pins ADCs_wrapper_0/adc_b] [get_bd_pins DMA/ADC2_data]
connect_bd_net [get_bd_pins DMA/acquisition_in_progress_out_0] [get_bd_ports IO7] [get_bd_pins xlconcat_0/In0]
connect_bd_net -net ext_trig_0_1 [get_bd_ports ext_trig] [get_bd_pins DMA/ext_trig_0] [get_bd_pins xlconcat_0/In2]
connect_bd_net [get_bd_pins xlconcat_0/dout] [get_bd_ports led_o]
connect_bd_net [get_bd_pins DMA/start_sig] [get_bd_pins xlconcat_0/In1]
connect_bd_net [get_bd_pins c_counter_binary_0/Q] [get_bd_pins xlslice_0/Din]
connect_bd_net [get_bd_pins xlslice_0/Dout] [get_bd_pins xlconcat_0/In7]
connect_bd_net [get_bd_pins xlconstant_0/dout] [get_bd_pins xlconcat_0/In4] [get_bd_pins xlconcat_0/In5] [get_bd_pins xlconcat_0/In6]
connect_bd_net [get_bd_pins DMA/trig_value] [get_bd_pins xlconcat_0/In3]

# ---- address map ----
assign_bd_address -offset 0x00000000 -range 512M -target_address_space [get_bd_addr_spaces DMA/axi_datamover_0/Data_S2MM] [get_bd_addr_segs processing_system7_0/S_AXI_HP0/HP0_DDR_LOWOCM]
assign_bd_address -offset 0x80010000 -range 64K -target_address_space [get_bd_addr_spaces processing_system7_0/Data] [get_bd_addr_segs xadc_wiz_0/s_axi_lite/Reg]
assign_bd_address -offset 0x80070000 -range 64K -target_address_space [get_bd_addr_spaces processing_system7_0/Data] [get_bd_addr_segs DMA/axi_gpio_4/S_AXI/Reg]
assign_bd_address -offset 0x80080000 -range 64K -target_address_space [get_bd_addr_spaces processing_system7_0/Data] [get_bd_addr_segs DMA/axi_gpio_1/S_AXI/Reg]
assign_bd_address -offset 0x80090000 -range 64K -target_address_space [get_bd_addr_spaces processing_system7_0/Data] [get_bd_addr_segs DMA/axi_gpio_3/S_AXI/Reg]
assign_bd_address -offset 0x800A0000 -range 64K -target_address_space [get_bd_addr_spaces processing_system7_0/Data] [get_bd_addr_segs DMA/axi_gpio_0/S_AXI/Reg]
assign_bd_address -offset 0x800B0000 -range 64K -target_address_space [get_bd_addr_spaces processing_system7_0/Data] [get_bd_addr_segs DMA/acquisition_start_ex_0/S00_AXI/S00_AXI_reg]
assign_bd_address -offset 0x800C0000 -range 64K -target_address_space [get_bd_addr_spaces processing_system7_0/Data] [get_bd_addr_segs DMA/axi_gpio_2/S_AXI/Reg]
assign_bd_address -offset 0x800D0000 -range 64K -target_address_space [get_bd_addr_spaces processing_system7_0/Data] [get_bd_addr_segs SinWave_Output/axi_gpio_3/S_AXI/Reg]
assign_bd_address -offset 0x800E0000 -range 64K -target_address_space [get_bd_addr_spaces processing_system7_0/Data] [get_bd_addr_segs SinWave_Output/axi_gpio_4/S_AXI/Reg]
assign_bd_address -offset 0x800F0000 -range 64K -target_address_space [get_bd_addr_spaces processing_system7_0/Data] [get_bd_addr_segs firmware_version/axi_gpio_firmwareVersion/S_AXI/Reg]

validate_bd_design
save_bd_design
